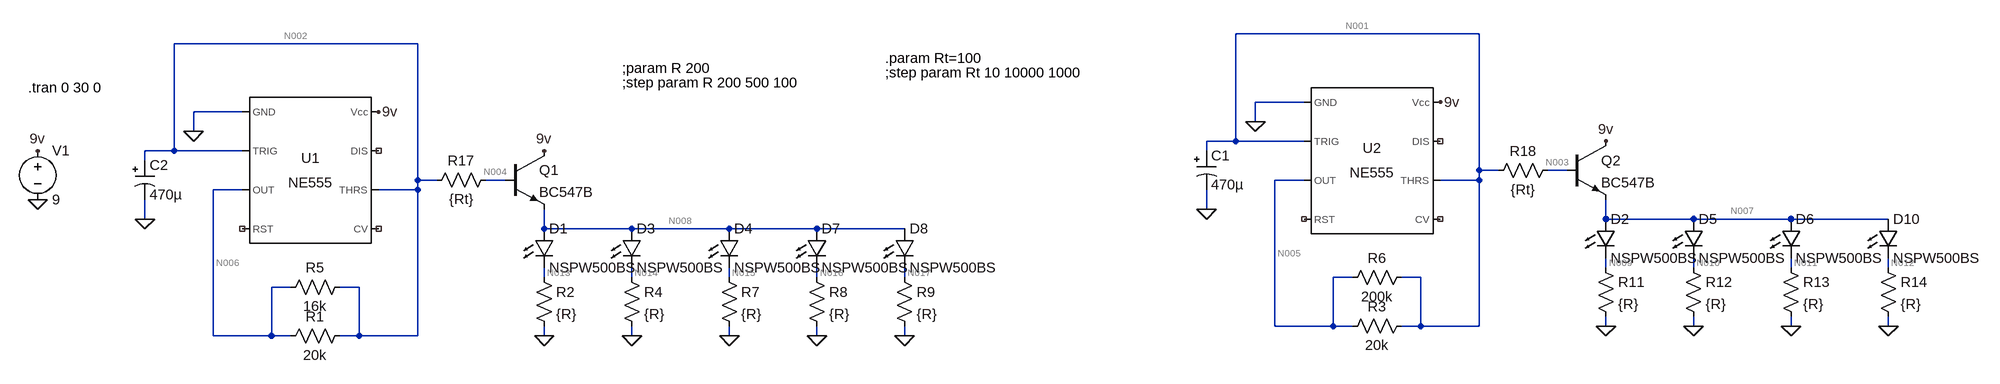
[diagram p0: schematic 555Breathing.asc]
555Breathing.asc, the LTspice schematic file:
Version 4
SHEET 1 5004 680
WIRE 2160 -32 1760 -32
WIRE 416 -16 16 -16
WIRE 1872 80 1792 80
WIRE 128 96 48 96
WIRE 1792 112 1792 80
WIRE 48 128 48 96
WIRE 1760 144 1760 -32
WIRE 1760 144 1712 144
WIRE 1872 144 1760 144
WIRE 16 160 16 -16
WIRE 16 160 -32 160
WIRE 128 160 16 160
WIRE 1712 160 1712 144
WIRE -32 176 -32 160
WIRE 2160 192 2160 -32
WIRE 2192 192 2160 192
WIRE 2304 192 2272 192
WIRE 416 208 416 -16
WIRE 448 208 416 208
WIRE 560 208 528 208
WIRE 1872 208 1824 208
WIRE 2160 208 2160 192
WIRE 2160 208 2096 208
WIRE 128 224 80 224
WIRE 416 224 416 208
WIRE 416 224 352 224
WIRE 1712 256 1712 224
WIRE -32 272 -32 240
WIRE 2368 272 2368 240
WIRE 2512 272 2368 272
WIRE 2672 272 2512 272
WIRE 2832 272 2672 272
WIRE 624 288 624 256
WIRE 768 288 624 288
WIRE 928 288 768 288
WIRE 1072 288 928 288
WIRE 1216 288 1072 288
WIRE 2368 352 2368 336
WIRE 2512 352 2512 336
WIRE 2672 352 2672 336
WIRE 2832 352 2832 336
WIRE 624 368 624 352
WIRE 768 368 768 352
WIRE 928 368 928 352
WIRE 1072 368 1072 352
WIRE 1216 368 1216 352
WIRE 1952 368 1920 368
WIRE 2064 368 2032 368
WIRE 208 384 176 384
WIRE 320 384 288 384
WIRE 1824 448 1824 208
WIRE 1920 448 1920 368
WIRE 1920 448 1824 448
WIRE 1952 448 1920 448
WIRE 2064 448 2064 368
WIRE 2064 448 2032 448
WIRE 2160 448 2160 208
WIRE 2160 448 2064 448
WIRE 2368 448 2368 432
WIRE 2512 448 2512 432
WIRE 2672 448 2672 432
WIRE 2832 448 2832 432
WIRE 80 464 80 224
WIRE 176 464 176 384
WIRE 176 464 80 464
WIRE 208 464 176 464
WIRE 320 464 320 384
WIRE 320 464 288 464
WIRE 416 464 416 224
WIRE 416 464 320 464
WIRE 624 464 624 448
WIRE 768 464 768 448
WIRE 928 464 928 448
WIRE 1072 464 1072 448
WIRE 1216 464 1216 448
FLAG 48 128 0
FLAG -32 272 0
FLAG -208 240 0
FLAG -208 160 9v
FLAG 352 96 9v
FLAG 624 160 9v
FLAG 624 464 0
FLAG 1792 112 0
FLAG 1712 256 0
FLAG 2096 80 9v
FLAG 2368 144 9v
FLAG 768 464 0
FLAG 928 464 0
FLAG 2368 448 0
FLAG 2512 448 0
FLAG 2672 448 0
FLAG 1072 464 0
FLAG 1216 464 0
FLAG 2832 448 0
SYMBOL Misc\\NE555 240 192 R0
SYMATTR InstName U1
SYMBOL polcap -48 176 R0
SYMATTR InstName C2
SYMATTR Value 470µ
SYMBOL res 304 448 R90
WINDOW 0 0 56 VBottom 2
WINDOW 3 32 56 VTop 2
SYMATTR InstName R1
SYMATTR Value 20k
SYMBOL voltage -208 144 R0
WINDOW 123 0 0 Left 0
WINDOW 39 0 0 Left 0
SYMATTR InstName V1
SYMATTR Value 9
SYMBOL npn 560 160 R0
SYMATTR InstName Q1
SYMATTR Value BC547B
SYMBOL LED 608 288 R0
SYMATTR InstName D1
SYMATTR Value NSPW500BS
SYMATTR Description Diode
SYMATTR Type diode
SYMBOL Misc\\NE555 1984 176 R0
SYMATTR InstName U2
SYMBOL polcap 1696 160 R0
SYMATTR InstName C1
SYMATTR Value 470µ
SYMBOL res 2048 432 R90
WINDOW 0 0 56 VBottom 2
WINDOW 3 32 56 VTop 2
SYMATTR InstName R3
SYMATTR Value 20k
SYMBOL npn 2304 144 R0
SYMATTR InstName Q2
SYMATTR Value BC547B
SYMBOL res 304 368 R90
WINDOW 0 0 56 VBottom 2
WINDOW 3 32 56 VTop 2
SYMATTR InstName R5
SYMATTR Value 16k
SYMBOL res 2048 352 R90
WINDOW 0 0 56 VBottom 2
WINDOW 3 32 56 VTop 2
SYMATTR InstName R6
SYMATTR Value 200k
SYMBOL LED 752 288 R0
SYMATTR InstName D3
SYMATTR Value NSPW500BS
SYMATTR Description Diode
SYMATTR Type diode
SYMBOL LED 912 288 R0
SYMATTR InstName D4
SYMATTR Value NSPW500BS
SYMATTR Description Diode
SYMATTR Type diode
SYMBOL LED 2352 272 R0
SYMATTR InstName D2
SYMATTR Value NSPW500BS
SYMATTR Description Diode
SYMATTR Type diode
SYMBOL LED 2496 272 R0
SYMATTR InstName D5
SYMATTR Value NSPW500BS
SYMATTR Description Diode
SYMATTR Type diode
SYMBOL LED 2656 272 R0
SYMATTR InstName D6
SYMATTR Value NSPW500BS
SYMATTR Description Diode
SYMATTR Type diode
SYMBOL LED 1056 288 R0
SYMATTR InstName D7
SYMATTR Value NSPW500BS
SYMATTR Description Diode
SYMATTR Type diode
SYMBOL LED 1200 288 R0
SYMATTR InstName D8
SYMATTR Value NSPW500BS
SYMATTR Description Diode
SYMATTR Type diode
SYMBOL LED 2816 272 R0
SYMATTR InstName D10
SYMATTR Value NSPW500BS
SYMATTR Description Diode
SYMATTR Type diode
SYMBOL res 608 352 R0
SYMATTR InstName R2
SYMATTR Value {R}
SYMBOL res 752 352 R0
SYMATTR InstName R4
SYMATTR Value {R}
SYMBOL res 912 352 R0
SYMATTR InstName R7
SYMATTR Value {R}
SYMBOL res 1056 352 R0
SYMATTR InstName R8
SYMATTR Value {R}
SYMBOL res 1200 352 R0
SYMATTR InstName R9
SYMATTR Value {R}
SYMBOL res 2352 336 R0
SYMATTR InstName R11
SYMATTR Value {R}
SYMBOL res 2496 336 R0
SYMATTR InstName R12
SYMATTR Value {R}
SYMBOL res 2656 336 R0
SYMATTR InstName R13
SYMATTR Value {R}
SYMBOL res 2816 336 R0
SYMATTR InstName R14
SYMATTR Value {R}
SYMBOL res 544 192 R90
WINDOW 0 0 56 VBottom 2
WINDOW 3 32 56 VTop 2
SYMATTR InstName R17
SYMATTR Value {Rt}
SYMBOL res 2288 176 R90
WINDOW 0 0 56 VBottom 2
WINDOW 3 32 56 VTop 2
SYMATTR InstName R18
SYMATTR Value {Rt}
TEXT -224 56 Left 2 !.tran 0 30 0
TEXT 752 48 Left 2 !;step param R 200 500 100
TEXT 752 24 Left 2 !;param R 200
TEXT 1184 32 Left 2 !;step param Rt 10 10000 1000
TEXT 1184 8 Left 2 !.param Rt=100

The netlist it stands for:
* 555Breathing.asc
XU1 0 N002 N006 NC_01 NC_02 N002 NC_03 9v NE555  ; pins GND TRIG OUT RST CV THRS DIS Vcc
C2 N002 0 470µ
R1 N002 N006 20k
V1 9v 0 9
Q1 9v N004 N008 0 BC547B
D1 N008 N013 NSPW500BS
XU2 0 N001 N005 NC_04 NC_05 N001 NC_06 9v NE555  ; pins GND TRIG OUT RST CV THRS DIS Vcc
C1 N001 0 470µ
R3 N001 N005 20k
Q2 9v N003 N007 0 BC547B
R5 N002 N006 16k
R6 N001 N005 200k
D3 N008 N014 NSPW500BS
D4 N008 N015 NSPW500BS
D2 N007 N009 NSPW500BS
D5 N007 N010 NSPW500BS
D6 N007 N011 NSPW500BS
D7 N008 N016 NSPW500BS
D8 N008 N017 NSPW500BS
D10 N007 N012 NSPW500BS
R2 N013 0 {R}
R4 N014 0 {R}
R7 N015 0 {R}
R8 N016 0 {R}
R9 N017 0 {R}
R11 N009 0 {R}
R12 N010 0 {R}
R13 N011 0 {R}
R14 N012 0 {R}
R17 N004 N002 {Rt}
R18 N003 N001 {Rt}
.model D D
.lib standard.dio
.model NPN NPN
.model PNP PNP
.lib standard.bjt
.tran 0 30 0
;step param R 200 500 100
;param R 200
;step param Rt 10 10000 1000
.param Rt=100
.lib NE555.sub
.backanno
.end

* Results of the author's LTspice run, read from the files saved beside the schematic
* Operating Point, zero values left out:
*   V(n002) = 7.295 V
*   V(9v) = 9 V
*   V(n006) = 8.999 V
*   V(n004) = 7.276 V
*   V(n008) = 6.513 V
*   V(n013) = 3.431 V
*   V(n001) = 6.782 V
*   V(n005) = 8.999 V
*   V(n003) = 6.769 V
*   V(n007) = 6.024 V
*   V(n014) = 3.431 V
*   V(n015) = 3.431 V
*   V(n009) = 2.974 V
*   V(n010) = 2.974 V
*   V(n011) = 2.974 V
*   V(n016) = 3.431 V
*   V(n017) = 3.431 V
*   V(n012) = 2.974 V
*   Ic(Q2) = 29.62 mA
*   Ib(Q2) = 122 µA
*   Ie(Q2) = -29.74 mA
*   Ic(Q1) = 42.7 mA
*   Ib(Q1) = 191.6 µA
*   Ie(Q1) = -42.89 mA
*   I(D10) = 7.434 mA
*   I(D8) = 8.577 mA
*   I(D7) = 8.577 mA
*   I(D6) = 7.434 mA
*   I(D5) = 7.434 mA
*   I(D2) = 7.434 mA
*   I(D4) = 8.577 mA
*   I(D3) = 8.577 mA
*   I(D1) = 8.577 mA
*   I(R18) = -122 µA
*   I(R17) = -191.6 µA
*   I(R14) = 7.434 mA
*   I(R13) = 7.434 mA
*   I(R12) = 7.434 mA
*   I(R11) = 7.434 mA
*   I(R9) = 8.577 mA
*   I(R8) = 8.577 mA
*   I(R7) = 8.577 mA
*   I(R4) = 8.577 mA
*   I(R2) = 8.577 mA
*   I(R6) = -11.09 µA
*   I(R5) = -106.5 µA
*   I(R3) = -110.9 µA
*   I(R1) = -85.17 µA
*   I(V1) = -78.44 mA
*   Ix(u1:1) = -2.907 mA
*   Ix(u1:2) = 7.295 nA
*   Ix(u1:3) = -191.6 µA
*   Ix(u1:6) = 7.295 nA
*   Ix(u1:8) = 3.098 mA
*   Ix(u2:1) = -2.907 mA
*   Ix(u2:2) = 6.782 nA
*   Ix(u2:3) = -122 µA
*   Ix(u2:6) = 6.782 nA
*   Ix(u2:8) = 3.029 mA
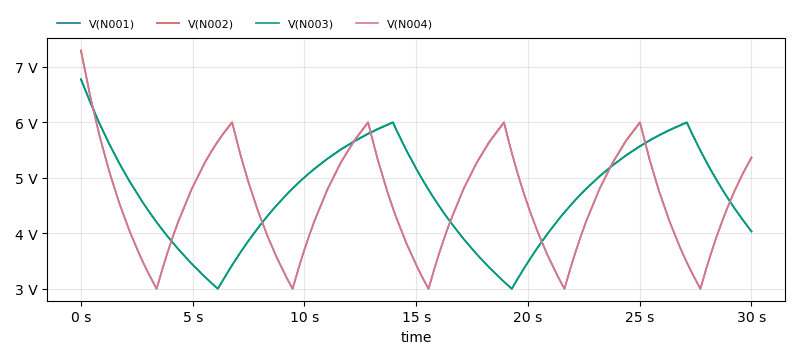
[diagram p1: Transient Analysis of 555Breathing.asc, plotted from the saved traces]
* Transient Analysis, 1 run:
*   V(N001): min 2.999 V, max 6.782 V, average 4.693 V, rms 4.782 V, last 4.034 V
*   V(N002): min 2.999 V, max 7.295 V, average 4.561 V, rms 4.657 V, last 5.367 V
*   V(N003): min 2.999 V, max 6.769 V, average 4.689 V, rms 4.777 V, last 4.032 V
*   V(N004): min 2.999 V, max 7.276 V, average 4.556 V, rms 4.651 V, last 5.358 V